# EAGLE design p2-003 (EAGLE 9.6.2)
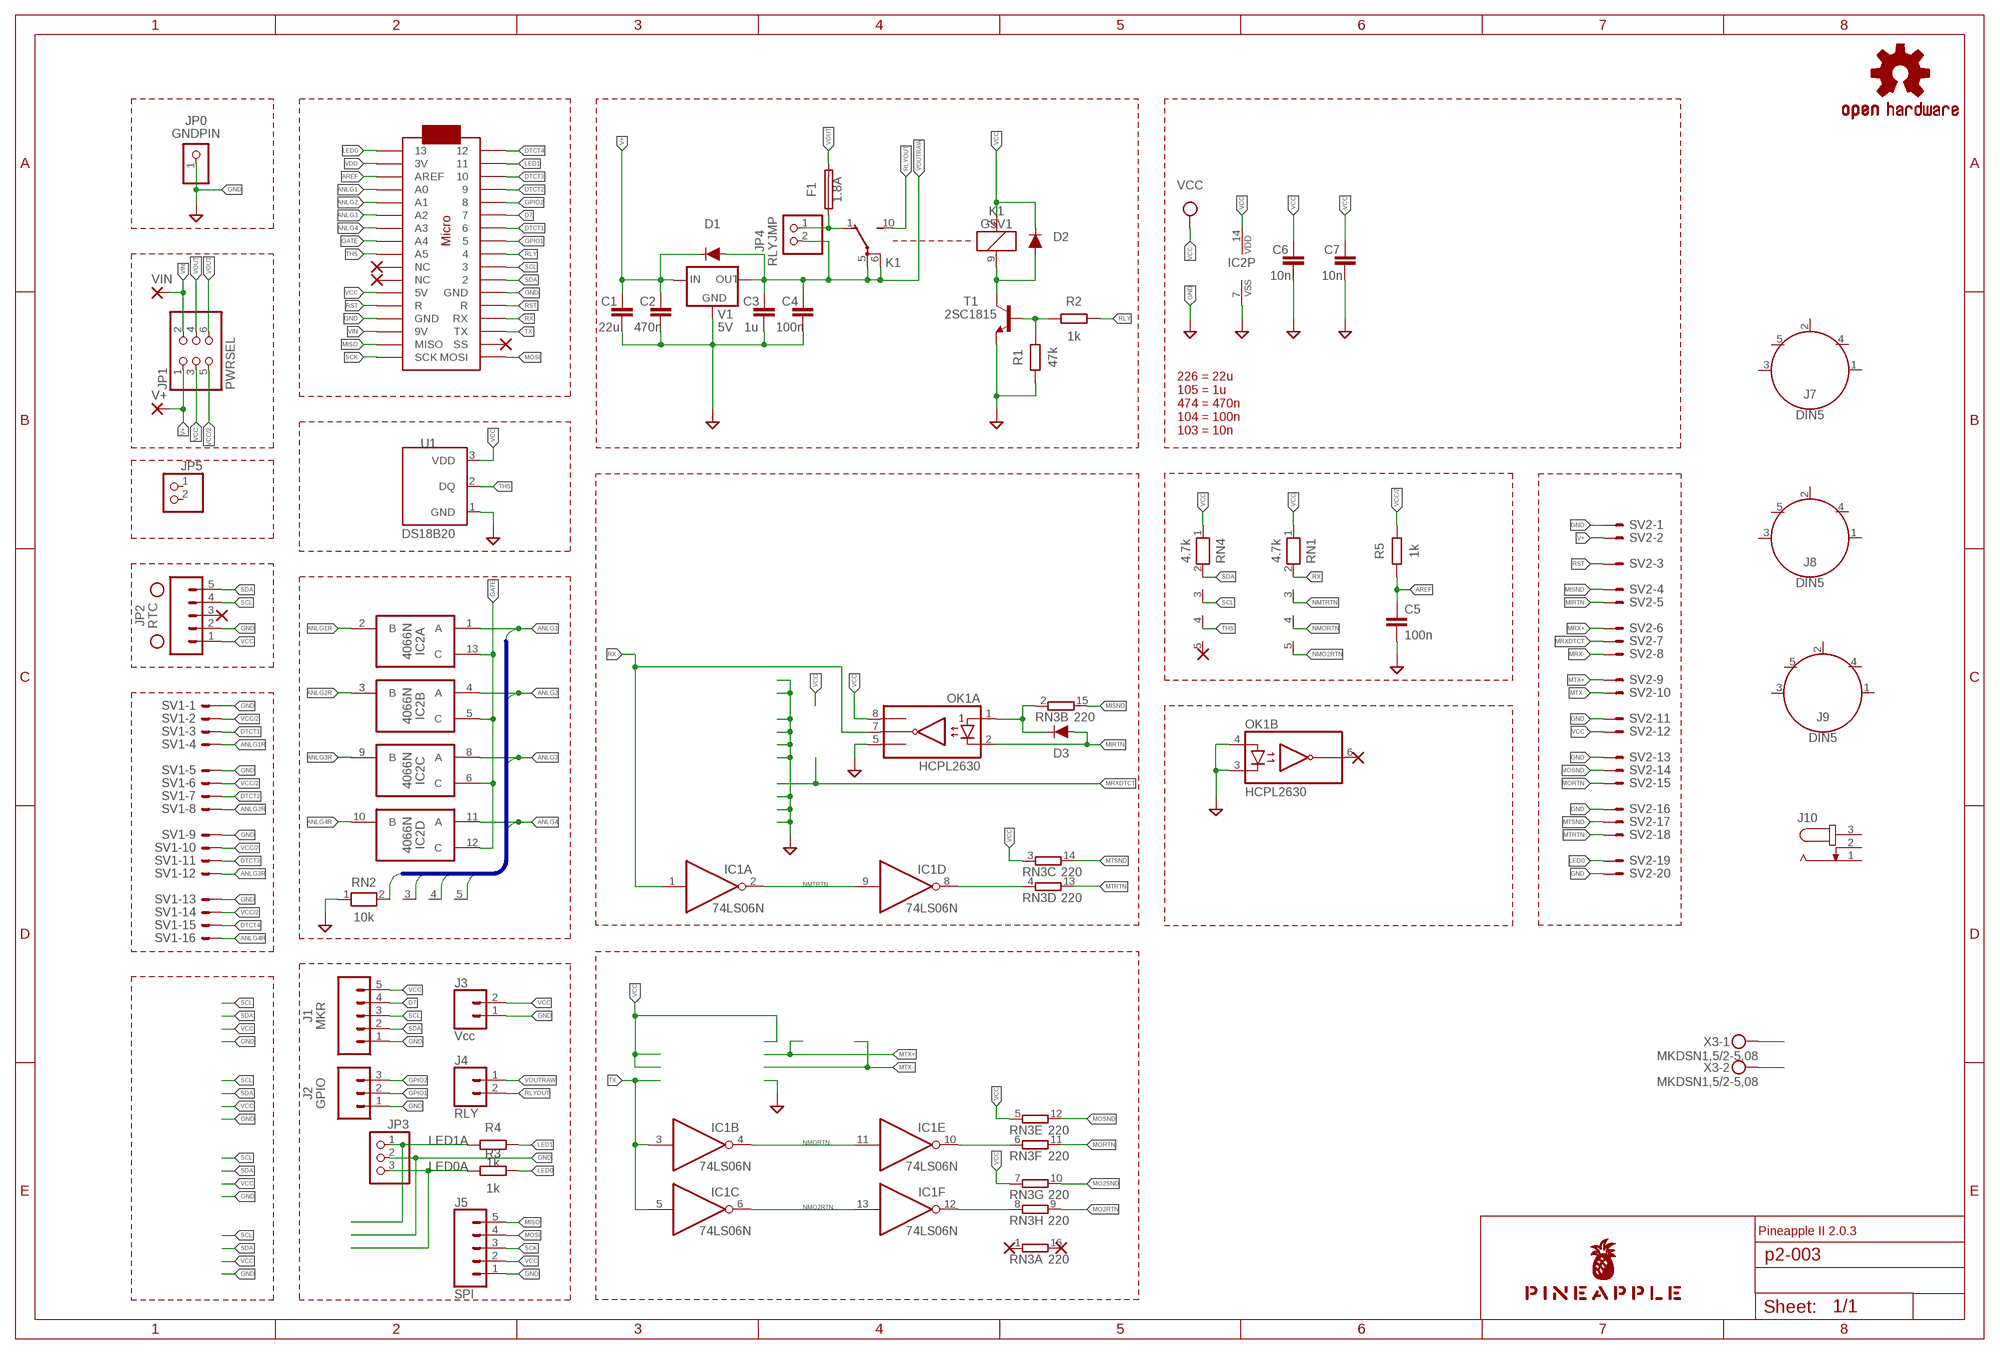
[diagram p0: schematic, sheet 1]

## Parts
C1  22u  C-EU025-050X050  [C025-050X050]
C2  470n  C-EU050-024X044  [C050-024X044]
C3  1u  C-EU050-024X044  [C050-024X044]
C4  100n  C-EU025-024X044  [C025-024X044]
C5  100n  C-EU025-024X044  [C025-024X044]
C6  10n  C-EU025-024X044  [C025-024X044]
C7  10n  C-EU025-024X044  [C025-024X044]
D1  DIODE-1N4148  [DIODE-1N4148]
D2  DIODE-1N4148  [DIODE-1N4148]
D3  DIODE-1N4148  [DIODE-1N4148]
F1  1.8A  TE5  [TE5]
H1  STAND-OFF  [STAND-OFF]
H2  STAND-OFF  [STAND-OFF]
IC1  74LS06N  [DIL14]
IC2  4066N  [DIL14]
J1  MKR  CONN_05JST  [JST-5-PTH]
J2  GPIO  CONN_03JST-PTH  [JST-3-PTH]
J3  Vcc  CONN_02JST-PTH-2  [JST-2-PTH]
J4  RLY  CONN_02-JST-2MM-SMT  [JST-2-SMD]
J5  SPI  CONN_05JST-VERT  [JST-5-PTH-VERT]
J7  DIN5  [DIN5-RA-PTH]
J8  DIN5  [DIN5-RA-PTH]
J9  DIN5  [DIN5-RA-PTH]
J10  JACK-PLUG0  [SPC4077]
JP0  GNDPIN  PINHD-1X1  [1X01]
JP1  PWRSEL  PINHD-2X3  [2X03]
JP2  RTC  CONN_05  [1X05]
JP3  PINHD-1X3  [1X03]
JP4  RLYJMP  PINHD-1X2  [1X02]
JP5  PINHD-1X2  [1X02]
K1  G5V1  [G5V1]
LOGO1  OSHW-LOGOS-COPPER  [OSHW-LOGO-S_COPPER]
MC1  ARDUINOMICRO  [ARDUINOMICRO]
OK1  HCPL2630  [DIL08]
R1  47k  R-EU_0204/5  [0204/5]
R2  1k  R-EU_0204/5  [0204/5]
R3  1k  R-EU_0204/5  [0204/5]
R4  1k  R-EU_0204/5  [0204/5]
R5  1k  R-EU_0204/5  [0204/5]
RN1  4.7k  RN04  [RN-5]
RN2  10k  RN04  [RN-5]
RN3  220  8R-N  [DIL16]
RN4  4.7k  RN04  [RN-5]
SV1  ML16LE  [ML16L]
SV2  ML20LE  [ML20L]
T1  2SC1815  [TO92-ECB]
U1  DS18B20  [TO-92-AMMO]
U$1  PINEAPPLE450_SILK  [PINEAPPLE450_SILK]
V1  5V  78XXL  [78XXL]
V+  SMD2  [SMD1,27-2,54]
VIN  SMD2  [SMD1,27-2,54]
X3  MKDSN1,5/2-5,08  [MKDSN1,5/2-5,08]

## Nets
ANLG1: IC2.1(A:A) MC1.P$31(A0) RN2.2
ANLG1R: IC2.2(A:B) SV1.4
ANLG2: IC2.4(B:A) MC1.P$30(A1) RN2.3
ANLG2R: IC2.3(B:B) SV1.8
ANLG3: IC2.8(C:A) MC1.P$29(A2) RN2.4
ANLG3R: IC2.9(C:B) SV1.12
ANLG4: IC2.11(D:A) MC1.P$28(A3) RN2.5
ANLG4R: IC2.10(D:B) SV1.16
AREF: C5.1 MC1.P$32(AREF) R5.1
D7: J1.4 MC1.P$6
DTCT1: MC1.P$7 SV1.3
DTCT2: MC1.P$4 SV1.7
DTCT3: MC1.P$3 SV1.11
DTCT4: MC1.P$1 SV1.15
GATE: IC2.5(B:C) IC2.6(C:C) IC2.12(D:C) IC2.13(A:C) MC1.P$27(A4)
GND [gnd]: C1.2 C2.2 C3.2 C4.2 C5.2 C6.2 C7.2 IC2.7(P:VSS) J1.1 J2.1 J3.1 J5.1 JP0.1 JP2.2 JP3.2 MC1.P$12(GND) MC1.P$21(GND) OK1.3(B:C2) OK1.4(B:A2) OK1.5(A:GND) R1.1 RN2.1 SV1.1 SV1.5 SV1.9 SV1.13 SV2.1 SV2.11 SV2.13 SV2.16 SV2.20 T1.E U1.1(GND) V1.GND X3.1
GPIO1: J2.2 MC1.P$8
GPIO2: J2.3 MC1.P$5
LED0: MC1.P$34 R3.2 SV2.19
LED0A: JP3.3 R3.1
LED1: MC1.P$2 R4.2
LED1A: JP3.1 R4.1
MIDIINSND: D3.C OK1.1(A:A1) RN3.2
MIRTN: D3.A OK1.2(A:C1) SV2.5
MISND: RN3.15 SV2.4
MISO: J5.5 MC1.P$19(MISO)
MO2RTN: RN3.9
MO2RTNRAW: IC1.12(F:O) RN3.8
MO2SND: RN3.10
MORTN: RN3.11 SV2.15
MORTNRAW: IC1.10(E:O) RN3.6
MOSI: J5.4 MC1.P$17(MOSI)
MOSND: RN3.12 SV2.14
MRX+: SV2.6
MRX-: SV2.8
MRXDTCT: SV2.7
MTRTN: RN3.13 SV2.18
MTRTNRAW: IC1.8(D:O) RN3.4
MTSND: RN3.14 SV2.17
MTX+: SV2.9
MTX-: SV2.10
NMO2RTN: IC1.6(C:O) IC1.13(F:I) RN1.5
NMORTN: IC1.4(B:O) IC1.11(E:I) RN1.4
NMTRTN: IC1.2(A:O) IC1.9(D:I) RN1.3
RLY: MC1.P$9 R2.2
RLYDRV: R1.2 R2.1 T1.B
RLYOUT: J4.2 K1.10(2:S)
RLYSNK: D2.A K1.9 T1.C
RST: MC1.P$13(R) MC1.P$22(R) SV2.3
RX: IC1.1(A:I) MC1.P$14(RX) OK1.7(A:VO1) RN1.2
SCK: J5.3 MC1.P$18(SCK)
SCL: J1.3 JP2.4 MC1.P$10 RN4.3
SDA: J1.2 JP2.5 MC1.P$11 RN4.2
THS: MC1.P$26(A5) RN4.4 U1.2(DQ)
TX: IC1.3(B:I) IC1.5(C:I) MC1.P$15(TX)
V+ [power]: C1.1 C2.1 D1.C JP1.1 SV2.2 V1.IN V+.1(P) X3.2
VCC [power]: C6.1 C7.1 D2.C IC2.14(P:VDD) J1.5 J3.2 J5.2 JP1.3 JP2.1 K1.2 MC1.P$23(5V) OK1.8(A:VCC) RN1.1 RN3.3 RN3.5 RN3.7 RN4.1 SV2.12 U1.3(VDD)
VCC/2 [power]: JP1.5 R5.2 SV1.2 SV1.6 SV1.10 SV1.14
VDD [power]: MC1.P$33(3V)
VIN [power]: JP1.2 MC1.P$20(9V) VIN.1(P)
VOUT [power]: F1.2 JP1.4 JP1.6
VOUTRAW [power]: C3.1 C4.1 D1.A J4.1 JP4.2 K1.5(2:P) K1.6(2:P) V1.OUT
VOUTRAW2 [power]: F1.1 JP4.1 K1.1(2:O)
Unconnected: J7.1 J7.2 J7.3 J7.4 J7.5 J8.1 J8.2 J8.3 J8.4 J8.5 J9.1 J9.2 J9.3 J9.4 J9.5 J10.1 J10.2 J10.3 JP2.3 JP5.1 JP5.2 MC1.P$16(SS) MC1.P$24(NC) MC1.P$25(NC) OK1.6(B:VO2) RN3.1 RN3.16 RN4.5

## Buses
ANLG[1..4]

## Notes on the sheet
- 226 = 22u
  105 = 1u
  474 = 470n
  104 = 100n
  103 = 10n
- Pineapple II 2.0.3

## Power pins joined to a net without a drawn wire
GND: IC1.7(P:GND)
VCC: IC1.14(P:VCC)

## Library data of the parts
C1-C5 = rcl:C-EU: CAPACITOR, European symbol; SPICEPREFIX: C
C6 C7 = resistor:C-EU: CAPACITOR, European symbol
D1-D3 = SparkFun-DiscreteSemi:DIODE: Diode These are standard reverse protection diodes and small signal diodes. SparkFun Products: SparkFun SparkPunk Sound Kit <https://www.sparkfun.com/products/11177> SparkFun ESP8266 Thing <https://www.sparkfun.com/products/13231>; PROD_ID: DIO-08378; VALUE: 200mA/100V/1V
F1 = fuse:TE5: FUSE Wickmann; OC_FARNELL: unknown; OC_NEWARK: unknown
H1 H2 = SparkFun-Hardware:STAND-OFF: Stand Off Drill holes for mechanically mounting via screws, standoffs, etc. Note: Use the keepout ring to avoid running the screw head into surrounding components. Variant Overviews STAND-OFF - Mechanical footprint for a #4 phillips button head screw. STAND-OFF-TIGHT - Mechanical footprint for a #4 phillips button head screw, Example SparkFun Products Screw - Phillips Head (1/4", 4-40, 10 pack) (PRT-10453) Screw - Phillips Head (1/2", 4-40, 10 pack) (PRT-10452) Screw - Phillips Head (3/4", 4-40, 10 pack) (PRT-10451) Screw - Phillips Head (1", 4-40, 10 pack) (PRT-10450)
IC1 = 74xx-us:74*06: Hex INVERTER, open collector high-voltage output
IC2 = 40xx:4066: Quad bilateral ANALOG SWITCH
J1 = SparkFun-Connectors:CONN_05: Multi connection point. Often used as Generic Header-pin footprint for 0.1 inch spaced/style header connections On any of the 0.1 inch spaced packages, you can populate with these: Break Away Headers - Straight (PRT-00116) Break Away Male Headers - Right Angle (PRT-00553) Female Headers (PRT-00115) Break Away Headers - Machine Pin (PRT-00117) Break Away Female Headers - Swiss Machine Pin (PRT-00743) For SCREWTERMINALS and SPRING TERMINALS visit here: Screw Terimnals on SparkFun.com (5mm/3.5mm/2.54mm spacing) This device is also useful as a general connection point to wire up your design to another part of your project. Our various solder wires solder well into these plated through hole pads. Hook-Up Wire - Assortment (Stranded, 22 AWG) (PRT-11375) Hook-Up Wire - Assortment (Solid Core, 22 AWG) (PRT-11367) View the entire wire category on our website here Special notes: Molex polarized connector foot print use with SKU : PRT-08231 with associated crimp pins and housings. 1MM SMD Version SKU: PRT-10208; SF_ID: PRT-09917
J2 = SparkFun-Connectors:CONN_03: Multi connection point. Often used as Generic Header-pin footprint for 0.1 inch spaced/style header connections On any of the 0.1 inch spaced packages, you can populate with these: Break Away Headers - Straight (PRT-00116) Break Away Male Headers - Right Angle (PRT-00553) Female Headers (PRT-00115) Break Away Headers - Machine Pin (PRT-00117) Break Away Female Headers - Swiss Machine Pin (PRT-00743) Stackable Header - 3 Pin (Female, 0.1") (PRT-13875) For SCREWTERMINALS and SPRING TERMINALS visit here: Screw Terimnals on SparkFun.com (5mm/3.5mm/2.54mm spacing) This device is also useful as a general connection point to wire up your design to another part of your project. Our various solder wires solder well into these plated through hole pads. Hook-Up Wire - Assortment (Stranded, 22 AWG) (PRT-11375) Hook-Up Wire - Assortment (Solid Core, 22 AWG) (PRT-11367) View the entire wire category on our website here Special notes: Molex polarized connector foot print use with SKU : PRT-08232 with associated crimp pins and housings.; PROD_ID: WIRE-10037; SF_ID: PRT-09915
J3 = SparkFun-Connectors:CONN_02: Multi connection point. Often used as Generic Header-pin footprint for 0.1 inch spaced/style header connections On any of the 0.1 inch spaced packages, you can populate with these: Break Away Headers - Straight (PRT-00116) Break Away Male Headers - Right Angle (PRT-00553) Female Headers (PRT-00115) Break Away Headers - Machine Pin (PRT-00117) Break Away Female Headers - Swiss Machine Pin (PRT-00743) For SCREWTERMINALS and SPRING TERMINALS visit here: Screw Terimnals on SparkFun.com (5mm/3.5mm/2.54mm spacing) This device is also useful as a general connection point to wire up your design to another part of your project. Our various solder wires solder well into these plated through hole pads. Hook-Up Wire - Assortment (Stranded, 22 AWG) (PRT-11375) Hook-Up Wire - Assortment (Solid Core, 22 AWG) (PRT-11367) View the entire wire category on our website here Special notes: Molex polarized connector foot print use with: PRT-08233 with associated crimp pins and housings. 2.54_SCREWTERM for use with PRT-10571. 3.5mm Screw Terminal footprints for PRT-08084 5mm Screw Terminal footprints for use with PRT-08432; PROD_ID: CONN-09863; SKU: PRT-09914
J4 = SparkFun-Connectors:CONN_02: Multi connection point. Often used as Generic Header-pin footprint for 0.1 inch spaced/style header connections On any of the 0.1 inch spaced packages, you can populate with these: Break Away Headers - Straight (PRT-00116) Break Away Male Headers - Right Angle (PRT-00553) Female Headers (PRT-00115) Break Away Headers - Machine Pin (PRT-00117) Break Away Female Headers - Swiss Machine Pin (PRT-00743) For SCREWTERMINALS and SPRING TERMINALS visit here: Screw Terimnals on SparkFun.com (5mm/3.5mm/2.54mm spacing) This device is also useful as a general connection point to wire up your design to another part of your project. Our various solder wires solder well into these plated through hole pads. Hook-Up Wire - Assortment (Stranded, 22 AWG) (PRT-11375) Hook-Up Wire - Assortment (Solid Core, 22 AWG) (PRT-11367) View the entire wire category on our website here Special notes: Molex polarized connector foot print use with: PRT-08233 with associated crimp pins and housings. 2.54_SCREWTERM for use with PRT-10571. 3.5mm Screw Terminal footprints for PRT-08084 5mm Screw Terminal footprints for use with PRT-08432; PROD_ID: CONN-11443
J5 JP2 = SparkFun-Connectors:CONN_05: Multi connection point. Often used as Generic Header-pin footprint for 0.1 inch spaced/style header connections On any of the 0.1 inch spaced packages, you can populate with these: Break Away Headers - Straight (PRT-00116) Break Away Male Headers - Right Angle (PRT-00553) Female Headers (PRT-00115) Break Away Headers - Machine Pin (PRT-00117) Break Away Female Headers - Swiss Machine Pin (PRT-00743) For SCREWTERMINALS and SPRING TERMINALS visit here: Screw Terimnals on SparkFun.com (5mm/3.5mm/2.54mm spacing) This device is also useful as a general connection point to wire up your design to another part of your project. Our various solder wires solder well into these plated through hole pads. Hook-Up Wire - Assortment (Stranded, 22 AWG) (PRT-11375) Hook-Up Wire - Assortment (Solid Core, 22 AWG) (PRT-11367) View the entire wire category on our website here Special notes: Molex polarized connector foot print use with SKU : PRT-08231 with associated crimp pins and housings. 1MM SMD Version SKU: PRT-10208
J7-J9 = SparkFun-Connectors:DIN5: DIN5 Connector - Female Right Angle (frequently used as a MIDI Jack connector) This type of connector and cable is frequently used for transmitting midi data (musical instrument digital interface). It is what you usually see on a keyboard or set of electronic drums. Learn more here. For more information on the pinout and electrical specifications of MIDI communications, please see the following resource: https://www.midi.org/specifications/item/midi-din-electrical-specification Here is the connector we sell at SparkFun: MIDI Connector - Female Right Angle (PRT-09536) Datasheet It is used on this SparkFun product: SparkFun MIDI Shield (DEV-12898); PROD_ID: CONN-09481
J10 = con-jack:JACK-PLUG: DC POWER JACK Power Jack, DC, Right Angle, Through Hole, Rated 5A at 16VDC, PC Terminals Distributor: Farnell (www.Farnell.de) Drawing: 84N1161.pdf / 84N1162.pdf Manufacturer: SPC Technology (www.spctechnology.com) Type: SPC4077 / SPC 4078; OC_FARNELL: unknown; OC_NEWARK: unknown
JP0 = pinhead:PINHD-1X1: PIN HEADER
JP1 = pinhead:PINHD-2X3: PIN HEADER
JP3 = pinhead:PINHD-1X3: PIN HEADER
JP4 JP5 = pinhead:PINHD-1X2: PIN HEADER
K1 = relay:G5V1: RELAY 1 x switch, 0.5 A/125 V AC, 1 A/24 V DC , Omron; MPN: G5V-1-DC24; OC_FARNELL: 9949593; OC_NEWARK: 36M6377
LOGO1 = SparkFun-Aesthetics:OSHW-LOGO: Open-Source Hardware (OSHW) Logo This logo indicates the piece of hardware it is found on incorporates a OSHW license and/or adheres to the definition of open source hardware found here: http://freedomdefined.org/OSHW
MC1 = adafruit:ARDUINOMICRO
OK1 = optocoupler:HCPL2630: HEWLETT PACKARD OPTO COUPLER; MF: AGILENT TECHNOLOGIES; MPN: HCPL-2630-000E; OC_FARNELL: 9994904; OC_NEWARK: 88H7813
R1-R5 = resistor:R-EU_: RESISTOR, European symbol
RN1 RN2 RN4 = resistor-net:RN04: RESISTOR NETWORK; OC_FARNELL: unknown; OC_NEWARK: unknown
RN3 = resistor-dil:8R-N: DIL RESISTOR; OC_FARNELL: unknown; OC_NEWARK: unknown
SV1 = con-ml:ML16LE: HARTING; OC_FARNELL: unknown; OC_NEWARK: unknown
SV2 = con-ml:ML20LE: HARTING; OC_FARNELL: unknown; OC_NEWARK: unknown
T1 = transistor:2SC1815: NPN EPITAXIAL TRANSISTOR Source: TOSHIBA .. 2SC1815 1.pdf
U1 = SparkFun-Sensors:DS18B20: Dallas/Maxim DS18B20 1-Wire Temperature Sensor The DS18B20 reports degrees C with 9 to 12-bit precision, -55C to 125C (+/-0.5C). Each sensor has a unique 64-Bit Serial number etched into it - allows for a huge number of sensors to be used on one data bus. Datasheet SparkFun Products One Wire Digital Temperature Sensor - DS18B20 (SEN-00245); STORE_ID: SEN-00245
U$1 = pineapple:PINEAPPLE450_SILK
V1 = v-reg:78XXL: VOLTAGE REGULATOR
V+ VIN = wirepad:SMD2: SMD PAD
X3 = con-phoenix-508:MKDSN1,5/2-5,08: MKDSN 1,5/ 2-5,08 Printklemme Nennstrom: 13,5 A Nennspannung: 250 V Rastermaß: 5,08 mm Polzahl: 2 Anschlussart: Schraubanschluss Montage: Löten Anschlussrichtung Leiter/Platine: 0 ° Artikelnummer: 1729128 Source: http://eshop.phoenixcontact.com .. 1729128.pdf

## Net classes
0 default: width 0.152 mm, drill 0.152 mm, clearance 0.152 mm
1 gnd: width 0.61 mm, drill 0.152 mm, clearance 0.152 mm
2 power: width 0.61 mm, drill 0.152 mm, clearance 0.152 mm
3 analog: width 0.305 mm, drill 0.152 mm, clearance 0.152 mm

## Board
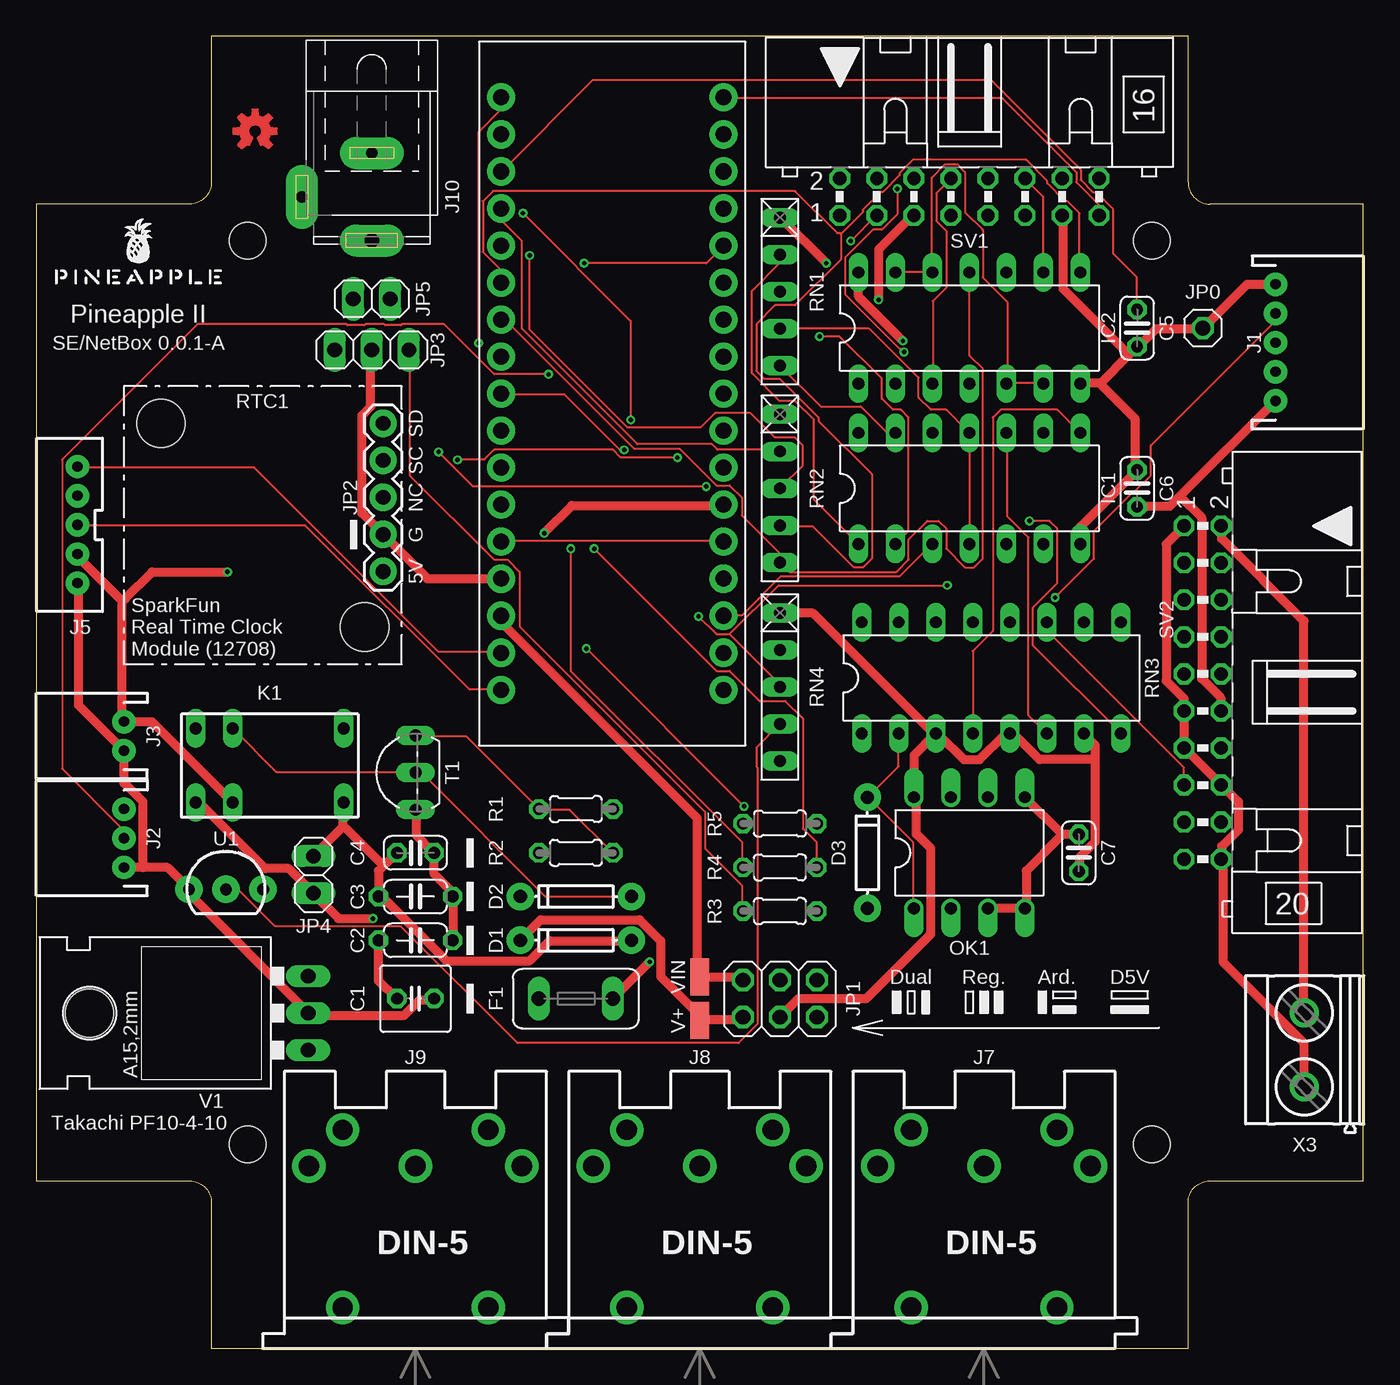
[diagram p1: board, top side]
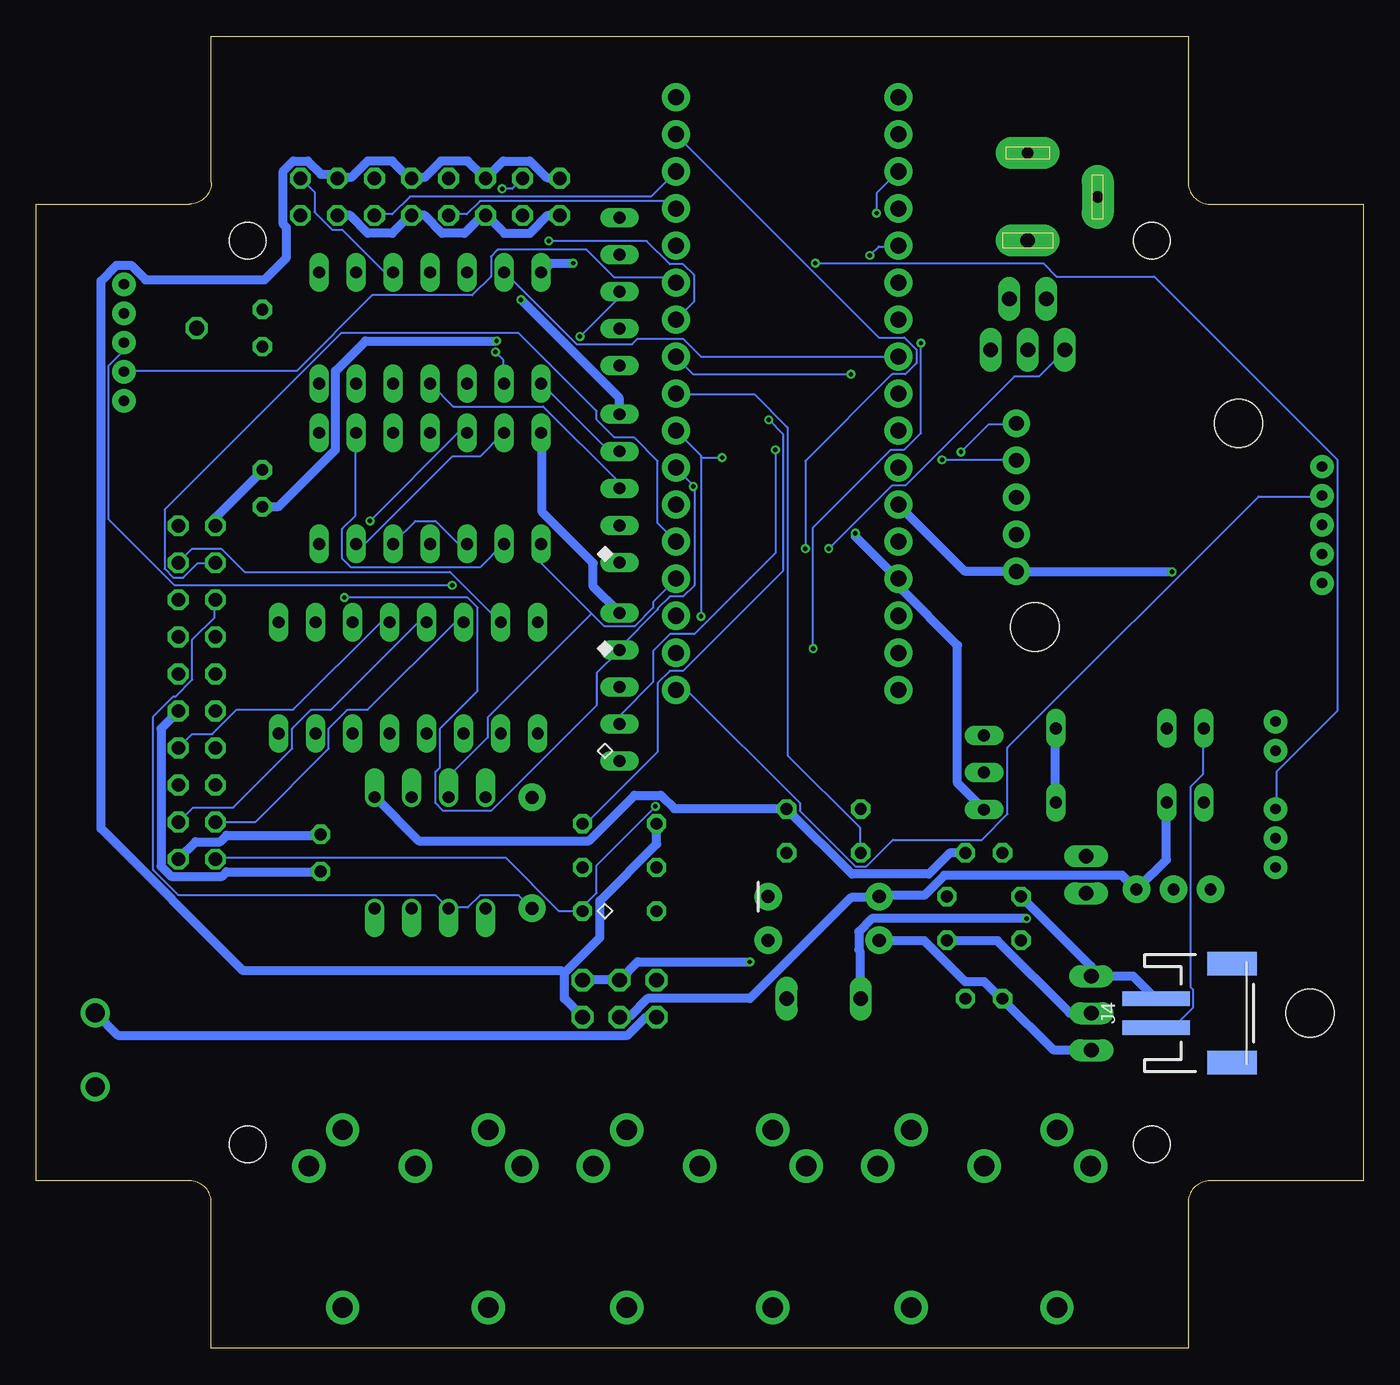
[diagram p2: board, bottom side, seen from below]

Size 91 x 90 mm. Coordinates in mm from the lower left corner, seen from the top.
Outline: 79,90 12,90 12,80 arc-90 10.5,78.5 0,78.5 0,11.5 10.5,11.5 arc-90 12,10 12,0 79,0 79,10 arc-90 80.5,11.5 91,11.5 91,78.5 80.5,78.5 arc-90 79,80 79,90
Copper layers (1*16): Top 0.035mm / dielectric 1.5mm / Bottom 0.035mm
Design rules "SeeedStudio_2layer_DRU_no_angle_20140221": minimum track width 6mil, minimum drill 12mil, track to track 6mil, track to pad 6mil, pad to pad 6mil, via to via 6mil, smd to smd 0mil, copper to edge 10mil, drill to drill 10mil, minimum pad ring 10mil, minimum via ring 6mil, stop-mask expansion 2mil, vias tented up to drill 100mil, thermal gap 10mil
Holes 2.5 mm at 76.5,76 14.5,76 14.5,14 76.5,14
tRestrict: area 12.3,73.8 to 16.7,78.2; area 74.3,73.8 to 78.7,78.2; area 12.3,11.8 to 16.7,16.2; area 74.3,11.8 to 78.7,16.2; area 12,89 to 79,90; area 90,11.5 to 91,78.5; area 12,0 to 79,1; area 0,11.5 to 1,78.5; area 0,77.5 to 13,78.5; area 12,77.5 to 13,90; area 78,77.5 to 79,90; area 78,77.5 to 91,78.5; 4 more areas
bRestrict: area 12.3,11.8 to 16.7,16.2; area 74.3,11.8 to 78.7,16.2; area 74.3,73.8 to 78.7,78.2; area 12.3,73.8 to 16.7,78.2; area 78,0 to 79,12.5; area 78,11.5 to 91,12.5; area 90,11.5 to 91,78.5; area 78,77.5 to 91,78.5; area 78,77.5 to 79,90; area 12,89 to 79,90; area 12,77.5 to 13,90; area 0,77.5 to 13,78.5; 4 more areas

### Footprints (pad centres in the part's own frame; a part is rotated, then mirrored left to right if it is on the bottom)
C025-050X050 = drill 0.813 octagon: 1 -1.27,0; 2 1.27,0
C050-024X044 = drill 0.813 octagon: 1 -2.54,0; 2 2.54,0
C025-024X044 = drill 0.813 octagon: 1 -1.27,0; 2 1.27,0
DIODE-1N4148 = drill 0.9 pad 1.88: A -3.81,0; C 3.81,0
TE5 = drill 1.016 long: 1 -2.54,0; 2 2.54,0
STAND-OFF = hole 3.302: 0,0
DIL14 = drill 0.813 long: 1 -7.62,-3.81; 2 -5.08,-3.81; 3 -2.54,-3.81; 4 0,-3.81; 5 2.54,-3.81; 6 5.08,-3.81; 7 7.62,-3.81; 8 7.62,3.81; 9 5.08,3.81; 10 2.54,3.81; 11 0,3.81; 12 -2.54,3.81; 13 -5.08,3.81; 14 -7.62,3.81
JST-5-PTH = drill 0.7 pad 1.6: 1 -4,0; 2 -2,0; 3 0,0; 4 2,0; 5 4,0
JST-3-PTH = drill 0.7 pad 1.6: 1 -2,0; 2 0,0; 3 2,0
JST-2-PTH = drill 0.7 pad 1.6: 1 -1,0; 2 1,0
JST-2-SMD = smd 1 x 4.6: 1 -1,-3.7; 2 1,-3.7 | smd 1.6 x 3.4: NC1 -3.4,1.5; NC2 3.4,1.5
JST-5-PTH-VERT = drill 0.7 pad 1.6: 1 -4,0.18; 2 -2,0.18; 3 0,0.18; 4 2,0.18; 5 4,0.18
DIN5-RA-PTH = drill 1.4 pad 2.286: 1 7.3,12.5; 2 0,12.5; 3 -7.3,12.5; 4 5,15; 5 -5,15; 6 -5,2.8; 7 5,2.8
SPC4077 = drill 0.8 pad 2.184 long: 1 -3,0; 2 0,-4.8 | drill 1 pad 2.184 long: 3 3,0
1X01 = drill 1.016 octagon: 1 0,0
2X03 = drill 1.016 octagon: 1 -2.54,-1.27; 2 -2.54,1.27; 3 0,-1.27; 4 0,1.27; 5 2.54,-1.27; 6 2.54,1.27
1X05 = drill 1.016 pad 1.88: 1 0,0; 2 2.54,0; 3 5.08,0; 4 7.62,0; 5 10.16,0
1X03 = drill 1.016 long: 1 -2.54,0; 2 0,0; 3 2.54,0
1X02 = drill 1.016 long: 1 -1.27,0; 2 1.27,0
G5V1 = drill 0.813 long: 1 -5.08,-2.54; 2 -2.54,-2.54; 5 5.08,-2.54; 6 5.08,2.54; 9 -2.54,2.54; 10 -5.08,2.54
ARDUINOMICRO = drill 1.1 pad 1.93: P$1 -20.32,7.62; P$2 -17.78,7.62; P$3 -15.24,7.62; P$4 -12.7,7.62; P$5 -10.16,7.62; P$6 -7.62,7.62; P$7 -5.08,7.62; P$8 -2.54,7.62; P$9 0,7.62; P$10 2.54,7.62; P$11 5.08,7.62; P$12 12.7,-7.62; P$13 10.16,-7.62; P$14 12.7,7.62; P$15 15.24,7.62; P$16 17.78,7.62; P$17 20.32,7.62; P$18 20.32,-7.62; P$19 17.78,-7.62; P$20 15.24,-7.62; P$21 7.62,7.62; P$22 10.16,7.62; P$23 7.62,-7.62; P$24 5.08,-7.62; P$25 2.54,-7.62; P$26 0,-7.62; P$27 -2.54,-7.62; P$28 -5.08,-7.62; P$29 -7.62,-7.62; P$30 -10.16,-7.62; P$31 -12.7,-7.62; P$32 -15.24,-7.62; P$33 -17.78,-7.62; P$34 -20.32,-7.62
DIL08 = drill 0.813 offset: 1 -3.81,-3.81; 2 -1.27,-3.81; 3 1.27,-3.81; 4 3.81,-3.81; 5 3.81,3.81; 6 1.27,3.81; 7 -1.27,3.81; 8 -3.81,3.81
0204/5 = drill 0.813 octagon: 1 -2.54,0; 2 2.54,0
RN-5 = drill 0.813 long: 1 -5.08,0; 2 -2.54,0; 3 0,0; 4 2.54,0; 5 5.08,0
DIL16 = drill 0.813 long: 1 -8.89,-3.81; 2 -6.35,-3.81; 3 -3.81,-3.81; 4 -1.27,-3.81; 5 1.27,-3.81; 6 3.81,-3.81; 7 6.35,-3.81; 8 8.89,-3.81; 9 8.89,3.81; 10 6.35,3.81; 11 3.81,3.81; 12 1.27,3.81; 13 -1.27,3.81; 14 -3.81,3.81; 15 -6.35,3.81; 16 -8.89,3.81
ML16L = drill 0.914 octagon: 1 -8.89,-1.27; 2 -8.89,1.27; 3 -6.35,-1.27; 4 -6.35,1.27; 5 -3.81,-1.27; 6 -3.81,1.27; 7 -1.27,-1.27; 8 -1.27,1.27; 9 1.27,-1.27; 10 1.27,1.27; 11 3.81,-1.27; 12 3.81,1.27; 13 6.35,-1.27; 14 6.35,1.27; 15 8.89,-1.27; 16 8.89,1.27
ML20L = drill 0.914 octagon: 1 -11.43,-1.27; 2 -11.43,1.27; 3 -8.89,-1.27; 4 -8.89,1.27; 5 -6.35,-1.27; 6 -6.35,1.27; 7 -3.81,-1.27; 8 -3.81,1.27; 9 -1.27,-1.27; 10 -1.27,1.27; 11 1.27,-1.27; 12 1.27,1.27; 13 3.81,-1.27; 14 3.81,1.27; 15 6.35,-1.27; 16 6.35,1.27; 17 8.89,-1.27; 18 8.89,1.27; 19 11.43,-1.27; 20 11.43,1.27
TO92-ECB = drill 0.813 long: B 2.54,0; C 0,0; E -2.54,0
TO-92-AMMO = drill 0.813 pad 1.88: 1 -2.54,0; 2 0,0; 3 2.54,0
78XXL = drill 1.016 long: GND 0,-3.81; IN -2.54,-3.81; OUT 2.54,-3.81 | hole 3.302: 0,11.176
SMD1,27-2,54 = smd 1.27 x 2.54: 1 0,0
MKDSN1,5/2-5,08 = drill 1.3 pad 2: 1 -2.561,0.025; 2 2.519,0.025

### Placement (x,y rotation side)
C1  26,24 0 top
C2  26,28 0 top
C3  26,31 0 top
C4  26,34 0 top
C5  75.5,70 270 top
C6  75.5,59 90 top
C7  71.5,34 90 top
D1  37,28 180 top
D2  37,31 180 top
D3  57,34 90 top
F1  37,24 0 top
H1  22.51,49.49 0 top
H2  8.54,63.46 0 top
IC1  64,59 0 top
IC2  64,70 0 top
J1  85,69 270 top
J2  6,35 90 top
J3  6,42 90 top
J4  10.5,23 270 bottom
J5  3,56.5 90 top
J7  65,0 0 top
J8  45.5,0 0 top
J9  26,0 0 top
J10  23,79 270 top
JP0  80,70 0 top
JP1  51,24 0 top
JP2  23.78,53.3 90 top
JP3  23,68.5 0 top
JP4  19,32.5 90 top
JP5  23,72 0 top
K1  16,40 0 top
LOGO1  15,83.5 0 top
MC1  39.5,65.5 270 top
OK1  64,34 0 top
R1  37,37 180 top
R2  37,34 180 top
R3  51,30 0 top
R4  51,33 0 top
R5  51,36 180 top
RN1  51,72.5 270 top
RN2  51,59 270 top
RN3  65.5,46 0 top
RN4  51,45.38 270 top
SV1  64,79 0 top
SV2  80,45 270 top
T1  26,39.5 90 top
U1  13,31.5 0 top
U$1  7,73 0 top
V1  14.82,23 90 top
V+  45.5,22.5 0 top
VIN  45.5,25.5 0 top
X3  87,20.5 90 top

### Tracks (layer width: path | path; a pad name or v marks a point on that pad's centre or on a via)
ANLG1
  Top 0.152: MC1.P$31 31.93,78.18 31.93,77.34 33.3,75.97 33.3,69.95 41.22,62.03 46.33,62.03 46.71,61.65 50.9,61.65 50.98,61.57 RN2.2
  Bottom 0.152: RN2.2 51.05,61.57 51.74,61.57 56.31,66.14 IC2.1
ANLG1R  (via drill 0.3)
  Top 0.152: v59.51,68.35 59.28,68.58 59.21,68.58 55.47,72.31 55.47,74.83 57.38,76.73 57.99,76.73 59.05,77.8 v59.05,79.55
  Bottom 0.152: v59.51,68.35 58.98,67.82 58.98,66.22 IC2.2 | v59.05,79.55 58.37,79.55 57.68,80.24 SV1.4
ANLG2  (via drill 0.3)
  Top 0.152: v33.83,74.98 33.83,69.88 40.54,63.17 45.57,63.17 46.56,64.16 49,64.16 50.67,62.48 52.05,62.48 52.58,61.95 52.58,60.58 51.05,59.05 RN2.3
  Bottom 0.152: RN2.3 51.05,59.05 51.05,59.44 56.24,64.62 62.41,64.62 63.93,66.14 IC2.4 | v33.83,74.98 33.22,75.59 31.93,75.59 MC1.P$30
ANLG2R
  Top 0.152: IC2.3 61.49,66.22 61.49,71.86 62.41,72.77 62.41,76.66 61.72,77.34 61.72,79.25 62.71,80.24 SV1.8
ANLG3
  Top 0.152: 55.21,76.47 56.69,77.95 56.69,78.11 57.91,79.32 58.06,79.32 59.21,80.47 59.21,80.62 60.12,81.53 67.89,81.53 69.34,80.09 69.34,79.93 70.56,78.72 70.71,78.72 71.55,77.88 71.55,73.84 IC2.8 | 55.21,76.47 55.17,76.43 55.17,74.68 52.05,71.55 50.67,71.55 49.38,70.26 49.38,67.06 49.91,66.52 50.98,66.52 53.65,63.86 53.65,63.63 57.3,59.97 57.3,54.18 56.69,53.57 56.08,53.57 53.26,56.39 51.05,56.39 RN2.4 | MC1.P$29 31.85,73.15 31.85,73.99 30.63,75.21 30.63,78.72 31.32,79.4 52.05,79.4 54.94,76.5 55.17,76.5 55.21,76.47
ANLG3R
  Top 0.152: IC2.9 69.04,73.84 69.04,79.02 67.82,80.24 SV1.12
ANLG4
  Top 0.152: MC1.P$28 31.93,70.56 32.16,70.56 41,61.72 44.12,61.72 46.63,59.21 47.55,59.21 48.39,58.37 48.39,57.15 50.98,54.56 50.98,53.95 RN2.5 51.05,53.87 51.66,53.26 58.98,53.26 59.82,54.1 59.82,55.47 61.11,56.77 61.87,56.77 62.41,56.24 62.41,54.86 63.7,53.57 64.31,53.57 64.92,54.18 64.92,67.21 64.01,68.12 64.01,73.76 IC2.11
ANLG4R
  Bottom 0.152: IC2.10 66.6,73.84 67.13,73.84 70.03,76.73 70.71,76.73 71.93,77.95 71.93,79.32 72.85,80.24 SV1.16
AREF  (via drill 0.3)
  Top 0.152: v40.77,63.7 40.77,70.48 v33.38,77.88 | C5.1 75.44,71.32 75.44,73.53 73.84,75.13 73.84,78.18 72.69,79.32 72.47,79.32 71.63,80.16 71.63,80.85 65.46,87.02 38.18,87.02 31.93,80.77 MC1.P$32
  Bottom 0.152: v40.77,63.7 39.78,62.71 39.78,53.34 46.63,46.48 47.55,46.48 48.39,45.64 48.39,40.92 53.26,36.04 53.49,36.04 R5.1 | v33.38,77.88 33.38,79.25 31.93,80.7 MC1.P$32
D7
  Bottom 0.152: J1.4 84.96,67.06 73.15,67.06 67.97,72.24 61.11,72.24 59.82,73.53 59.82,74.91 59.36,75.36 53.26,75.36 51.36,73.46 47.47,73.46 47.17,73.15 MC1.P$6
DTCT1  (via drill 0.3)
  Top 0.152: v55.85,75.97 57.61,77.72 SV1.3
  Bottom 0.152: v55.85,75.97 49.15,75.97 47.55,74.37 46.63,74.37 45.87,73.61 45.87,71.86 47.09,70.64 MC1.P$7
DTCT2
  Bottom 0.152: SV1.7 62.71,77.8 61.49,77.8 60.58,78.72 47.62,78.72 47.17,78.26 MC1.P$4
DTCT3
  Bottom 0.152: SV1.11 67.74,77.8 66.6,77.8 65.38,79.02 48.84,79.02 47.17,80.7 MC1.P$3
DTCT4
  Top 0.152: SV1.15 72.85,77.8 72.85,78.49 71.32,80.01 71.32,80.7 66.22,85.8 47.17,85.8 MC1.P$1
GATE
  Top 0.152: IC2.6 69.04,66.22 66.6,66.22 IC2.5 66.6,66.29 66.6,71.78 64.92,73.46 64.92,76.73 63.7,77.95 63.7,80.7 63.17,81.23 62.33,81.23 61.42,80.31 61.42,73.91 IC2.12 61.42,73.84 58.98,73.84 IC2.13
  Bottom 0.152: MC1.P$27 31.93,68.05 45.41,68.05 46.63,69.27 49.76,69.27 50.14,68.89 53.95,68.89 58.9,73.84 IC2.13
GND  (via drill 0.3)
  Top 0.61: JP3.2 22.94,68.43 22.94,64.62 22.33,64.01 22.33,57.3 23.77,55.85 JP2.2 24,55.63 26.82,52.81 31.85,52.81 MC1.P$12 | v34.82,55.93 36.73,57.84 47.09,57.84 MC1.P$21 | C2.2 28.57,28.04 28.57,30.94 C3.2 28.5,31.32 27.28,32.54 27.28,33.98 C4.2 27.05,34.21 26.06,35.2 26.06,36.96 T1.E | C1.2 27.2,23.93 26.29,23.93 25.22,22.86 18.75,22.86 18.67,22.94 V1.GND 18.44,23.24 10.44,31.24 U1.1 10.44,31.55 8.99,32.99 7.32,32.99 | 7.32,32.99 6.02,32.99 J2.1 | 7.32,32.99 7.32,37.49 6.02,38.79 6.02,41 J3.1 5.79,41.22 2.9,44.12 2.9,52.43 J5.1 | OK1.3 65.3,30.18 67.74,30.18 OK1.4 67.89,30.48 67.89,32.77 70.18,35.05 70.33,35.28 | 70.33,35.28 71.48,35.28 C7.2 | 70.33,35.28 67.82,37.8 OK1.5 | X3.1 86.94,17.98 86.94,20.95 81.38,26.52 81.38,33.3 SV2.20 81.31,33.6 81.31,34.44 82.45,35.59 82.45,37.49 81.31,38.63 SV2.16 81.08,38.86 78.94,41 SV2.13 78.72,41.22 78.72,43.66 SV2.11 78.72,44.04 78.72,44.58 77.5,45.8 77.5,55.17 78.72,56.39 SV2.1 | IC1.7 71.63,55.24 71.63,56.39 75.44,60.2 C6.2 75.36,60.5 75.36,63.78 73.15,65.99 73,66.22 | 73,66.22 71.63,66.22 IC2.7 | 74.94,68.16 75.44,68.66 C5.2 75.74,68.89 76.81,69.95 79.93,69.95 JP0.1 80.24,70.18 83.06,73 84.96,73 J1.1 | 74.94,68.16 73,66.22 | v57.76,71.93 57.76,75.36 60.12,77.72 SV1.5 | 74.94,68.16 70.41,72.69 70.41,77.72 SV1.13
  Bottom 0.61: v34.82,55.93 34.82,55.7 31.93,52.81 MC1.P$12 31.77,52.5 31.77,52.2 27.81,48.23 27.81,38.79 26.06,37.03 T1.E | C4.2 27.28,33.98 28.35,33.98 29.79,32.54 35.05,32.54 39.47,36.96 R1.1 39.85,37.03 47.24,37.03 48.16,37.95 49.99,37.95 53.11,34.82 64.77,34.82 67.74,37.8 OK1.5 | C2.2 28.5,27.96 25.07,27.96 20.12,23.01 18.67,23.01 V1.GND | C7.2 71.55,35.2 77.95,35.2 78.41,34.75 80.09,34.75 81.23,33.6 SV2.20 | SV2.1 78.72,56.46 78.72,57 75.51,60.2 C6.2 | v57.76,71.93 51.05,65.23 51.05,64.08 RN2.1 | SV1.1 55.17,77.72 55.93,77.72 57.15,76.5 58.9,76.5 60.12,77.72 SV1.5 60.5,77.65 61.65,76.5 63.17,76.5 64.39,77.72 65.23,77.72 SV1.9 65.53,77.57 66.6,76.5 68.28,76.5 69.49,77.72 70.33,77.72 SV1.13
GPIO1  (via drill 0.3)
  Top 0.152: v35.13,66.83 31.39,66.83 27.96,70.26 25.07,70.26 24.99,70.18 23.93,70.18 23.85,70.26 22.55,70.26 22.48,70.18 21.34,70.18 21.26,70.26 11.05,70.26 1.75,60.96 1.75,39.78 5.94,35.59 5.94,35.05 J2.2
  Bottom 0.152: v35.13,66.83 45.95,66.83 47.09,67.97 MC1.P$8
GPIO2  (via drill 0.3)
  Top 0.152: v37.57,74.45 45.95,74.45 47.09,75.59 MC1.P$5
  Bottom 0.152: v37.57,74.45 21.95,74.45 21.03,73.53 14.33,73.53 1.75,60.96 1.75,43.74 5.94,39.55 5.94,37.03 J2.3
LED0  (via drill 0.3)
  Top 0.152: v30.33,68.96 30.33,83.44 31.85,84.96 31.85,85.8 MC1.P$34 | v48.54,37.19 v37.72,48.01
  Bottom 0.152: SV2.19 78.72,33.6 78.64,33.68 58.83,33.68 55.17,30.02 53.57,30.02 R3.2 53.57,30.1 53.57,30.25 52.58,31.24 52.58,33.15 v48.54,37.19 | v30.33,68.96 30.33,62.79 31.47,61.65 32.38,61.65 37.72,56.31 v37.72,48.01
LED0A
  Top 0.152: R3.1 48.39,30.02 48.39,31.77 45.87,34.29 45.87,36.8 33.15,49.53 33.15,53.26 32.31,54.1 31.39,54.1 25.6,59.89 25.6,68.43 JP3.3
LED1  (via drill 0.3)
  Top 0.152: v38.25,54.86 46.63,46.48 47.55,46.48 49.61,44.42 51.36,44.42 52.58,43.2 52.58,35.66 53.49,34.75 53.49,33.07 R4.2
  Bottom 0.152: v38.25,54.86 38.25,60.88 32.31,66.83 31.39,66.83 30.63,67.59 30.63,68.5 31.47,69.34 33.22,69.34 47.09,83.21 MC1.P$2
LED1A  (via drill 0.3)
  Top 0.152: v36.65,54.86 36.65,46.48 48.39,34.75 48.39,33.07 R4.1
  Bottom 0.152: v36.65,54.86 32.31,59.21 31.39,59.21 23.93,66.67 22.25,66.67 20.5,68.43 JP3.1
MIDIINSND
  Top 0.152: RN3.2 59.13,42.14 59.13,39.93 57.07,37.87 D3.C 57.07,37.8 60.12,34.75 60.12,30.25 OK1.1
MIRTN
  Bottom 0.152: D3.A 57.07,30.25 57.91,31.09 60.58,31.09 61.42,30.25 62.71,30.25 OK1.2 62.79,30.25 63.63,31.09 81.23,31.09 82.98,32.84 82.98,43.36 81.61,44.73 81.46,44.73 80.31,45.87 80.31,48.62 78.79,50.14 78.79,51.28 SV2.5
MISND
  Bottom 0.152: RN3.15 59.21,49.84 62.64,53.26 76.73,53.26 78.33,54.86 80.31,54.86 81.23,53.95 SV2.4
MISO
  Top 0.152: J5.5 2.9,60.43 14.94,60.43 27.58,47.78 31.85,47.78 MC1.P$19
MO2RTNRAW  (via drill 0.3)
  Top 0.152: v68.12,56.77 69.49,56.77 70.03,56.24 70.03,52.5 68.35,50.83 68.35,48.23 74.37,42.22 RN3.8
  Bottom 0.152: v68.12,56.77 62.1,62.79 61.49,62.79 IC1.12
MORTN
  Top 0.152: RN3.11 69.34,49.76 69.34,49.23 78.72,39.85 78.72,38.71 SV2.15
MORTNRAW
  Top 0.152: IC1.10 66.6,62.79 66.6,57.07 68.05,55.63 68.05,43.43 69.27,42.22 RN3.6
MOSI
  Bottom 0.152: J5.4 2.9,58.45 7.16,58.45 24.38,41.22 24.38,36.65 26.14,34.9 32.23,34.9 34.06,33.07 34.82,33.07 38.63,36.88 38.63,37.41 46.33,45.11 47.09,45.11 MC1.P$17
MOSND
  Bottom 0.152: RN3.12 66.83,49.76 67.44,49.76 73.38,43.81 77.27,43.81 78.94,42.14 80.31,42.14 81.23,41.22 SV2.14
MTRTN
  Bottom 0.152: RN3.13 64.24,49.76 64.85,49.76 70.79,43.81 72.16,43.81 73.46,42.52 73.46,41.15 77.5,37.11 80.24,37.11 81.23,36.12 SV2.18
MTRTNRAW
  Top 0.152: RN3.4 64.24,42.22 64.24,47.85 65.61,49.23 65.61,63.86 66.14,64.39 70.03,64.39 71.55,62.87 IC1.8
MTSND
  Bottom 0.152: RN3.14 61.72,49.76 62.33,49.76 68.28,43.81 69.65,43.81 70.94,42.52 70.94,41.15 75.97,36.12 78.72,36.12 SV2.17
NMO2RTN
  Top 0.152: IC1.13 58.9,62.87 58.29,62.87 56.54,64.62 53.8,64.62 51.05,67.36 RN1.5
  Bottom 0.152: IC1.6 69.04,55.24 68.43,55.24 62.48,61.19 60.58,61.19 58.98,62.79 IC1.13
NMORTN
  Top 0.152: RN1.4 51.05,69.95 57.15,69.95 60.5,66.6 60.5,65.23 61.34,64.39 62.41,64.39 63.93,62.87 IC1.11 64.01,62.79 64.01,55.24 IC1.4
NMTRTN  (via drill 0.3)
  Top 0.152: v53.72,69.42 55.09,69.42 57.99,66.52 57.99,65.15 58.75,64.39 59.28,64.39 59.82,63.86 59.82,56.08 58.98,55.24 IC1.2
  Bottom 0.152: v53.72,69.42 51.05,72.08 51.05,72.47 RN1.3 | IC1.9 69.11,62.79 69.11,57.15 70.03,56.24 70.03,54.18 69.42,53.57 60.58,53.57 58.98,55.17 IC1.2
RLY
  Bottom 0.152: R2.2 34.52,34.06 34.52,35.74 39.47,40.69 39.47,63.17 41.76,65.46 47.09,65.46 MC1.P$9
RLYDRV
  Top 0.152: R2.1 39.47,34.06 36.58,36.96 34.52,36.96 R1.2 34.44,37.03 29.49,41.99 26.06,41.99 T1.B
RLYOUT
  Bottom 0.152: K1.10 10.97,42.52 10.97,39.4 11.81,38.56 11.81,24.77 11.66,24.61 11.66,23.39 13.03,22.02 14.17,22.02 J4.2
RLYSNK
  Top 0.152: K1.9 13.49,42.52 16.46,39.55 25.98,39.55 T1.C 26.06,39.47 26.44,39.47 34.9,31.01 40.77,31.01 D2.A
RST
  Top 0.152: MC1.P$13 31.93,55.4 47.09,55.4 MC1.P$22
  Bottom 0.152: SV2.3 78.79,53.87 79.93,53.87 80.92,52.88 81.61,52.88 82.22,53.49 82.22,57.53 70.1,69.65 57.91,69.65 52.58,64.31 52.58,63.7 51.36,62.48 49.99,62.48 48.39,60.88 48.39,56.62 47.17,55.4 MC1.P$22
RX
  Top 0.152: RN1.2 50.98,74.98 50.98,74.45 49.07,72.54 49.07,66.9 50.98,65 52.05,65 53.34,63.7 53.34,58.22 56.31,55.24 IC1.1
  Bottom 0.152: 52.92,50.41 52.05,49.53 49.99,49.53 48.69,50.83 48.69,51.21 47.17,52.73 MC1.P$14 | 52.92,50.41 56.31,53.8 56.31,55.17 IC1.1 | 52.92,50.41 60.05,43.28 60.05,41.91 62.71,39.24 62.71,37.87 OK1.7
SCK
  Top 0.152: J5.3 2.9,56.46 18.44,56.46 29.72,45.19 31.85,45.19 MC1.P$18
SCL  (via drill 0.3)
  Top 0.152: 47.55,49 50.98,45.57 50.98,45.41 RN4.3 | 47.55,49 46.63,49 v45.41,50.22 | v62.48,52.35 50.9,52.35 47.55,49 | v28.88,60.96 30.71,60.96 31.39,61.65 39.55,61.65 40.08,61.11 v43.97,61.11
  Bottom 0.152: 45.41,61.11 45.41,61.27 47.09,62.94 MC1.P$10 | 45.41,61.11 v45.41,50.22 | v62.48,52.35 81.53,52.35 86.03,56.84 86.03,67.44 85.04,68.43 85.04,68.96 J1.3 | v28.88,60.96 23.85,60.96 JP2.4 | 45.41,61.11 v43.97,61.11
SDA  (via drill 0.3)
  Top 0.152: v69.88,51.51 72.54,54.18 72.54,56.08 75.13,58.67 75.21,58.67 76.43,59.89 76.43,61.95 84.96,70.48 84.96,70.94 J1.2 | v27.58,61.49 29.95,59.13 v45.95,59.13
  Bottom 0.152: 45.91,59.17 47.09,60.35 MC1.P$11 | 45.91,59.17 45.87,59.13 45.87,52.35 46.63,51.59 47.55,51.59 48.39,50.75 48.39,50.67 50.98,48.08 50.98,47.93 RN4.2 51.05,47.85 52.58,46.33 52.58,44.12 59.82,36.88 63.09,36.88 63.63,37.41 63.63,39.55 63.32,39.85 63.32,42.52 60.73,45.11 60.73,50.83 61.42,51.51 v69.88,51.51 | v27.58,61.49 25.68,63.4 23.85,63.4 JP2.5 | v45.95,59.13 45.91,59.17
THS  (via drill 0.3)
  Top 0.152: v40.31,61.65 40.01,61.65 36.2,65.46 31.93,65.46 MC1.P$26 | U1.2 13.03,31.47 13.87,31.47 16.38,28.96 24.99,28.96 32.99,20.95 48.16,20.95 49.45,22.25 49.45,39.85 49.38,39.93 49.38,41.22 50.98,42.82 RN4.4
  Bottom 0.152: v40.31,61.65 40.31,54.56 45.87,49 47.55,49 48.69,47.85 48.69,45.72 50.98,43.43 50.98,42.9 RN4.4
TX
  Top 0.152: MC1.P$15 47.17,50.29 48.39,50.29 51.05,52.96 59.21,52.96 61.42,55.17 IC1.3
  Bottom 0.152: IC1.3 61.49,55.24 62.1,55.24 63.63,56.77 65,56.77 66.52,55.24 IC1.5
V+
  Top 0.61: JP1.1 48.39,22.71 48.23,22.55 45.57,22.55 V+.1 45.49,22.86 42.82,25.53 42.82,27.96 41.38,29.41 34.59,29.41 33.22,28.04 D1.C | C2.1 23.47,27.96 23.47,25.22 24.69,24 C1.1 | SV2.2 81.31,56.39 81.31,55.55 86.94,49.91 86.94,23.09 X3.2
  Bottom 0.61: V1.IN 18.67,20.5 21.26,20.5 24.69,23.93 C1.1 24.99,24.16 25.98,25.15 27.28,25.15 30.1,27.96 33.15,27.96 D1.C | JP1.1 48.46,22.71 49.23,22.71 50.44,21.49 85.42,21.49 86.94,23.01 X3.2
VCC  (via drill 0.3)
  Top 0.61: 72.62,40.39 72.62,41.38 71.86,42.14 RN3.7 | 72.62,40.39 72.62,34.75 71.55,33.68 71.55,32.77 C7.1 | 72.62,40.39 68.81,40.39 67.06,42.14 66.83,42.14 RN3.5 66.52,42.06 66.37,42.06 64.69,40.39 63.63,40.39 61.95,42.06 RN3.3 | RN3.3 61.65,42.14 60.2,40.69 60.2,37.87 OK1.8 60.35,37.57 60.35,35.28 61.34,34.29 61.34,28.42 56.92,24 52.27,24 51.05,22.78 JP1.3 | RN4.1 51.05,50.44 53.26,50.44 61.42,42.29 RN3.3 | v54.18,74.45 51.05,77.57 RN1.1 | 78.45,58.48 84.96,65 J1.5 | 78.45,58.48 77.72,57.76 75.51,57.76 C6.1 | 78.45,58.48 79.93,57 79.93,45.95 81.23,44.65 81.23,43.74 SV2.12 | v59.44,69.11 56.39,72.16 56.39,73.76 IC2.14 | K1.2 13.41,37.49 7.92,42.98 6.02,42.98 J3.2 5.87,43.28 5.87,51.28 | 5.87,51.28 2.9,54.25 2.9,54.48 J5.2 | v13.11,53.26 7.92,53.26 6.1,51.44 5.87,51.28
  Bottom 0.61: IC1.14 56.31,62.79 56.31,57.38 52.81,53.87 52.81,52.27 51.05,50.52 RN4.1 | v54.18,74.45 55.7,74.45 56.31,73.84 IC2.14 | v59.44,69.11 68.43,69.11 70.48,67.06 70.48,61.65 74.37,57.76 75.44,57.76 C6.1 | C7.1 71.55,32.69 77.95,32.69 78.26,32.38 81.76,32.38 82.45,33.07 82.45,42.52 81.31,43.66 SV2.12 | JP1.3 50.98,22.78 50.29,22.78 49.07,24 42.06,24 35.13,30.94 33.22,30.94 D2.C 32.92,31.09 30.1,31.09 28.73,32.46 16.54,32.46 15.77,31.7 U1.3 15.47,31.55 13.49,33.53 13.49,37.41 K1.2 | MC1.P$23 31.85,57.84 27.36,53.34 23.85,53.34 JP2.1 23.47,53.26 v13.11,53.26
VCC/2
  Bottom 0.61: SV1.2 55.17,80.31 56.01,80.31 57.15,81.46 58.98,81.46 60.12,80.31 SV1.6 60.43,80.47 61.42,81.46 63.25,81.46 64.39,80.31 65.23,80.31 SV1.10 65.53,80.39 66.6,81.46 68.28,81.46 69.42,80.31 70.33,80.31 SV1.14 70.56,80.54 71.48,80.54 72.39,81.46 73.38,81.46 74.07,80.77 74.07,77.11 73.84,76.89 73.84,74.83 75.36,73.3 83.52,73.3 84.51,74.3 85.5,74.3 86.56,73.23 86.56,35.66 76.81,25.91 55.02,25.91 54.79,25.76 | 54.79,25.76 52.35,28.19 52.35,30.71 48.46,34.59 48.46,35.97 R5.2 | 54.79,25.76 54.79,24 53.57,22.78 JP1.5
VIN
  Top 0.61: JP1.2 48.39,25.3 48.23,25.45 45.57,25.45 VIN.1 45.34,25.76 45.34,36.35 31.93,49.76 31.93,50.22 MC1.P$20
VOUT  (via drill 0.3)
  Top 0.61: v42.06,26.52 F1.2
  Bottom 0.61: v42.06,26.52 49.76,26.52 50.98,25.3 JP1.4 51.28,25.3 53.49,25.3 JP1.6
VOUTRAW
  Top 0.61: 21.03,35.81 21.03,37.41 K1.5 | 21.03,35.81 19.05,33.83 JP4.2 | 23.81,33.11 24.69,33.98 C4.1 | 23.81,33.11 23.47,32.77 23.47,31.01 C3.1 23.77,30.94 28.12,26.59 33.83,26.59 35.2,27.96 40.77,27.96 D1.A | 23.81,33.11 21.26,35.66 21.03,35.81
  Bottom 0.61: K1.6 21.11,42.52 21.11,37.49 K1.5 | J4.1 14.25,24 15.77,25.53 18.59,25.53 V1.OUT 18.67,25.83 18.67,26.21 23.39,30.94 C3.1
VOUTRAW2  (via drill 0.3)
  Top 0.61: K1.1 10.97,37.41 11.2,37.41 15.7,32.92 17.3,32.92 18.97,31.24 JP4.1 19.2,31.01 20.73,29.49 v23.09,29.49
  Bottom 0.61: v23.09,29.49 33.68,29.49 34.59,28.57 34.59,27.36 34.52,27.28 34.52,24 F1.1

### Text on the board
tNames: Pineapple II | SE/NetBox 0.0.1-A | RTC1 | SD | SC | NC | G | 5V | SparkFun / Real Time Clock / Module (12708) | Dual | Reg. | Ard. | D5V | Takachi PF10-4-10